# EAGLE design ADC Keychain (EAGLE 7.1.0)
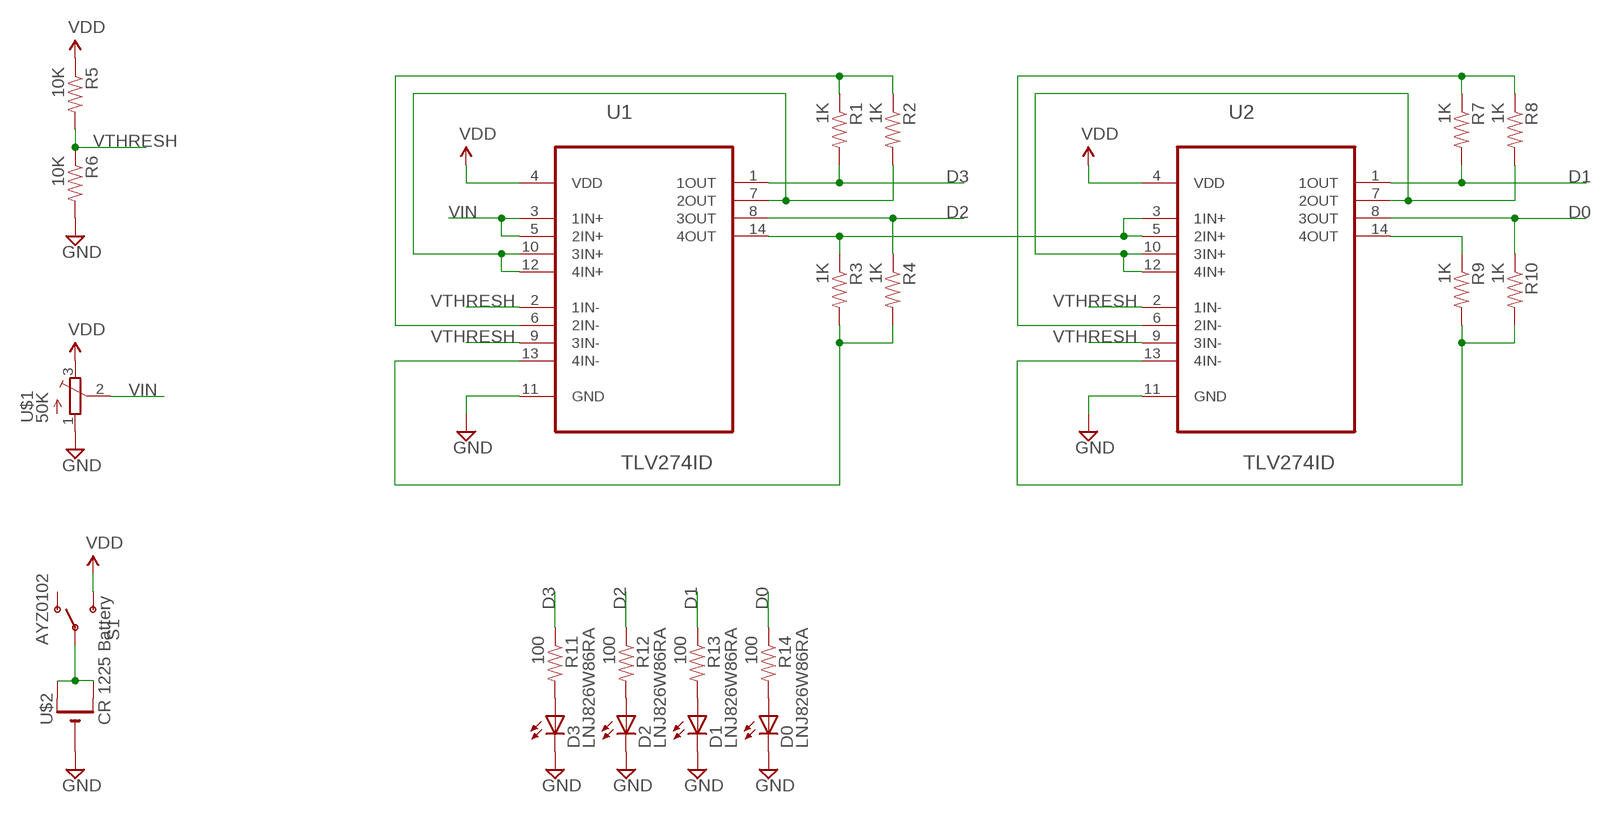
[diagram p0: schematic, sheet 1]

## Parts
D0  LNJ826W86RA  LEDCHIP-LED0603  [CHIP-LED0603]
D1  LNJ826W86RA  LEDCHIP-LED0603  [CHIP-LED0603]
D2  LNJ826W86RA  LEDCHIP-LED0603  [CHIP-LED0603]
D3  LNJ826W86RA  LEDCHIP-LED0603  [CHIP-LED0603]
R1  1K  1KOHM1/10W1%(0603)  [0603-RES]
R2  1K  1KOHM1/10W1%(0603)  [0603-RES]
R3  1K  1KOHM1/10W1%(0603)  [0603-RES]
R4  1K  1KOHM1/10W1%(0603)  [0603-RES]
R5  10K  1KOHM1/10W1%(0603)  [0603-RES]
R6  10K  1KOHM1/10W1%(0603)  [0603-RES]
R7  1K  1KOHM1/10W1%(0603)  [0603-RES]
R8  1K  1KOHM1/10W1%(0603)  [0603-RES]
R9  1K  1KOHM1/10W1%(0603)  [0603-RES]
R10  1K  1KOHM1/10W1%(0603)  [0603-RES]
R11  100  1KOHM1/10W1%(0603)  [0603-RES]
R12  100  1KOHM1/10W1%(0603)  [0603-RES]
R13  100  1KOHM1/10W1%(0603)  [0603-RES]
R14  100  1KOHM1/10W1%(0603)  [0603-RES]
S1  AYZ0102  SWITCH-SPDTSMD2  [SWITCH-SPDT-SMD]
U1  TLV274ID  [SOIC127P600X175-14N]
U2  TLV274ID  [SOIC127P600X175-14N]
U$1  50K  TRIMPOTTC33X  [TC33X]
U$2  CR 1225 Battery  CR1220SMT  [CR1220-SMD]

## Nets
D0: R10.1 R14.1 U2.8(3OUT)
D1: R7.2 R13.1 U2.1(1OUT)
D2: R4.1 R12.1 U1.8(3OUT)
D3: R1.2 R11.1 U1.1(1OUT)
GND: D0.C D1.C D2.C D3.C R6.2 U1.11(GND) U2.11(GND) U$1.1(A) U$2.-
N$1: D3.A R11.2
N$2: D2.A R12.2
N$3: R7.1 R8.1 U2.6(2IN-)
N$4: R1.1 R2.1 U1.6(2IN-)
N$5: R3.1 U1.14(4OUT) U2.3(1IN+) U2.5(2IN+)
N$6: D1.A R13.2
N$7: R3.2 R4.2 U1.13(4IN-)
N$8: R2.2 U1.7(2OUT) U1.10(3IN+) U1.12(4IN+)
N$9: R9.1 U2.14(4OUT)
N$10: D0.A R14.2
N$11: R9.2 R10.2 U2.13(4IN-)
N$12: R8.2 U2.7(2OUT) U2.10(3IN+) U2.12(4IN+)
N$14: S1.2(P) U$2.+$1(+) U$2.+$2(+1)
VDD: R5.1 S1.3(S) U1.4(VDD) U2.4(VDD) U$1.3(E)
VIN: U1.3(1IN+) U1.5(2IN+) U$1.2(S)
VTHRESH: R5.2 R6.1 U1.2(1IN-) U1.9(3IN-) U2.2(1IN-) U2.9(3IN-)
Unconnected: S1.1(O)

## Library data of the parts
D0 D1-D3 = led:LED: LED OSRAM: - CHIPLED LG R971, LG N971, LY N971, LG Q971, LY Q971, LO R971, LY R971 LH N974, LH R974 LS Q976, LO Q976, LY Q976 LO Q996 - Hyper CHIPLED LW Q18S LB Q993, LB Q99A, LB R99A - SideLED LS A670, LO A670, LY A670, LG A670, LP A670 LB A673, LV A673, LT A673, LW A673 LH A674 LY A675 LS A676, LA A676, LO A676, LY A676, LW A676 LS A679, LY A679, LG A679 - Hyper Micro SIDELED® LS Y876, LA Y876, LO Y876, LY Y876 LT Y87S - SmartLED LW L88C, LW L88S LB L89C, LB L89S, LG L890 LS L89K, LO L89K, LY L89K LS L896, LA L896, LO L896, LY L896 - TOPLED LS T670, LO T670, LY T670, LG T670, LP T670 LSG T670, LSP T670, LSY T670, LOP T670, LYG T670 LG T671, LOG T671, LSG T671 LB T673, LV T673, LT T673, LW T673 LH T674 LS T676, LA T676, LO T676, LY T676, LB T676, LH T676, LSB T676, LW T676 LB T67C, LV T67C, LT T67C, LS T67K, LO T67K, LY T67K, LW E67C LS E67B, LA E67B, LO E67B, LY E67B, LB E67C, LV E67C, LT E67C LW T67C LS T679, LY T679, LG T679 LS T770, LO T770, LY T770, LG T770, LP T770 LB T773, LV T773, LT T773, LW T773 LH T774 LS E675, LA E675, LY E675, LS T675 LS T776, LA T776, LO T776, LY T776, LB T776 LHGB T686 LT T68C, LB T68C - Hyper Mini TOPLED® LB M676 - Mini TOPLED Santana® LG M470 LS M47K, LO M47K, LY M47K Source: http://www.osram.convergy.de LUXEON: - LUMILED® LXK2-PW12-R00, LXK2-PW12-S00, LXK2-PW14-U00, LXK2-PW14-V00 LXK2-PM12-R00, LXK2-PM12-S00, LXK2-PM14-U00 LXK2-PE12-Q00, LXK2-PE12-R00, LXK2-PE12-S00, LXK2-PE14-T00, LXK2-PE14-U00 LXK2-PB12-K00, LXK2-PB12-L00, LXK2-PB12-M00, LXK2-PB14-N00, LXK2-PB14-P00, LXK2-PB14-Q00 LXK2-PR12-L00, LXK2-PR12-M00, LXK2-PR14-Q00, LXK2-PR14-R00 LXK2-PD12-Q00, LXK2-PD12-R00, LXK2-PD12-S00 LXK2-PH12-R00, LXK2-PH12-S00 LXK2-PL12-P00, LXK2-PL12-Q00, LXK2-PL12-R00 Source: www.luxeon.com KINGBRIGHT: KA-3528ASYC Source: www.kingbright.com
R1-R4 R7-R10 = SparkFun-Resistors:1KOHM1/10W1%(0603): RES-07856; PROD_ID: RES-07856
R5 R6 R11-R14 = SparkFun-Resistors:1KOHM1/10W1%(0603): RES-07856; PROD_ID: RES-07856; VALUE: 1K
S1 = SparkFun-Electromechanical:SWITCH-SPDT: SPDT Switch Simple slide switch, Spark Fun Electronics SKU : COM-00102 DPDT SMT slide switch, AYZ0202, SWCH-08179
U1 U2 = Texas Instruments_By_element14_Batch_1:TLV274ID: RAIL-TO-TO-RAIL OUTPUT OPAMP; MPN: TLV274ID; OC_FARNELL: 8455317; OC_NEWARK: 38K8452; PACKAGE: SOIC-14; SUPPLIER: Texas Instruments
U$1 = adafruit:TRIMPOT: SMT trimmer potentiometer part number TC33X http://www.ladyada.net/library/eagle
U$2 = adafruit:CR1220: CR1216/CR1220/CR1225 12mm 3V lithium coin cell Great for battery packup. Both SMT and THM holders. Note the THM package has the ground pads on both sides of the PCB so that the masks are the same - this reduces the cost

## Board
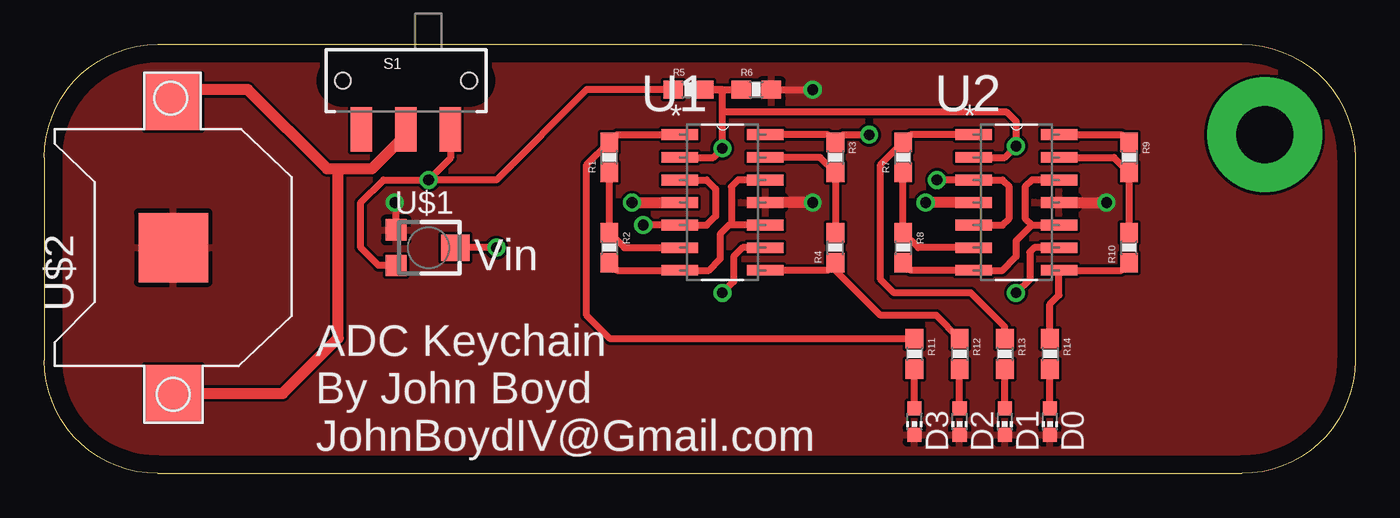
[diagram p1: board, top side]
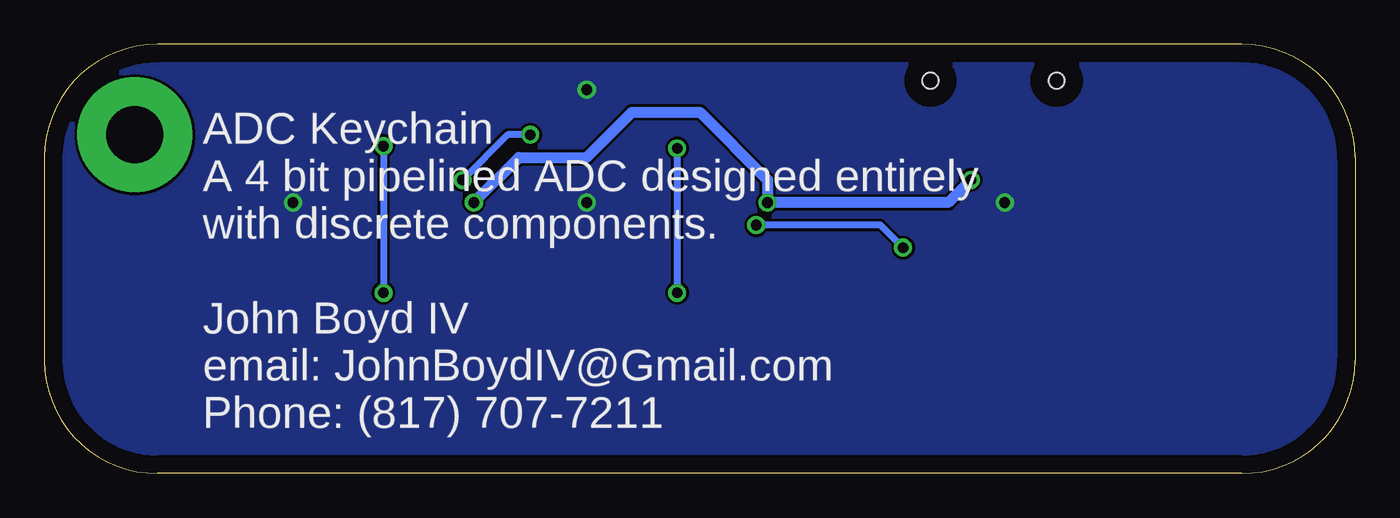
[diagram p2: board, bottom side, seen from below]

Size 73.66 x 24.13 mm. Coordinates in mm from the lower left corner, seen from the top.
Outline: 6.35,0 67.31,0 arc90 73.66,6.35 73.66,17.78 arc90 67.31,24.13 6.35,24.13 arc90 0,17.78 0,6.35 arc90 6.35,0
Copper layers (1*16): Top 0.035mm / dielectric 1.5mm / Bottom 0.035mm
Design rules "default *": minimum track width 10mil, minimum drill 13mil, track to track 6mil, track to pad 6mil, pad to pad 6mil, via to via 6mil, smd to smd 6mil, copper to edge 40mil, drill to drill 8mil, minimum pad ring 10mil, minimum via ring 8mil, stop-mask expansion 4mil, vias tented up to drill 0mil, thermal gap 10mil

### Footprints (pad centres in the part's own frame; a part is rotated, then mirrored left to right if it is on the bottom)
CHIP-LED0603 = smd 0.8 x 0.8: A 0,-0.75; C 0,0.75
0603-RES = smd 1.1 x 1: 1 -0.85,0; 2 0.85,0
SWITCH-SPDT-SMD = smd 1.2 x 2.5: 1 -2.5,-2.75; 2 0,-2.75; 3 2.5,-2.75 | hole 0.9: -3.55,0; 3.55,0
SOIC127P600X175-14N = smd 2.057 x 0.61: 1 -4.801,7.62; 2 -4.801,6.35; 3 -4.801,5.08; 4 -4.801,3.81; 5 -4.801,2.54; 6 -4.801,1.27; 7 -4.801,0; 8 0,0; 9 0,1.27; 10 0,2.54; 11 0,3.81; 12 0,5.08; 13 0,6.35; 14 0,7.62
TC33X = smd 1.2 x 1.2: 1 -1,-1.825; 3 1,-1.825 | smd 1.5 x 1.6: 2 0,1.5
CR1220-SMD = smd 3.2 x 3.2: +$1 -8.2,0; +$2 8.2,0 | smd 3.9 x 3.9: - 0,0

### Placement (x,y rotation side)
D0  56.52,2.92 180 top
D1  53.98,2.92 180 top
D2  51.44,2.92 180 top
D3  48.9,2.92 180 top
R1  31.75,17.78 90 top
R2  31.75,12.7 270 top
R3  44.45,17.78 270 top
R4  44.45,12.7 90 top
R5  36.2,21.59 0 top
R6  40.01,21.59 0 top
R7  48.26,17.78 90 top
R8  48.26,12.7 270 top
R9  60.96,17.78 270 top
R10  60.96,12.7 90 top
R11  48.9,6.73 270 top
R12  51.44,6.73 270 top
R13  53.98,6.73 270 top
R14  56.52,6.73 270 top
S1  20.32,22.1 0 top
U1  40.51,11.43 0 top
U2  57.02,11.43 0 top
U$1  21.59,12.7 270 top
U$2  7.24,12.7 90 top

### Tracks (layer width: path | path; a pad name or v marks a point on that pad's centre or on a via)
D0
  Top 0.406: R10.1 60.54,11.43 U2.8 57.02,10.03 56.52,9.53 R14.1
D1
  Top 0.406: U2.1 48.68,19.05 R7.2 46.99,17.36 46.99,10.92 47.75,10.16 52.07,10.16 53.98,8.26 R13.1
D2
  Top 0.406: U1.8 44.03,11.43 R4.1 44.45,11.43 46.99,8.89 50.13,8.89 R12.1
D3
  Top 0.406: U1.1 32.17,19.05 R1.2 30.48,17.36 30.48,8.89 31.79,7.58 R11.1
GND  (via drill 0.6, 0.6 pad 1.02)
  Top 0.406: R6.2 v43.18,21.59 | U$1.1 19.77,15.16 v19.68,15.24
  Top 0.61: v43.18,15.24 U1.11 | U2.11 v59.69,15.24
  pour Top: 6.35,0 arc-90 0,6.35 0,17.78 arc-90 6.35,24.13 67.31,24.13 arc-90 73.66,17.78 73.66,6.35 arc-90 67.31,0
  pour Bottom: 6.35,0 arc-90 0,6.35 0,17.78 arc-90 6.35,24.13 67.31,24.13 arc-90 73.66,17.78 73.66,6.35 arc-90 67.31,0
N$1
  Top 0.406: D3.A R11.2
N$2
  Top 0.406: D2.A R12.2
N$3
  Top 0.406: U2.6 49.11,12.7 R8.1 R7.1
N$4
  Top 0.406: R1.1 R2.1 32.6,12.7 U1.6
N$5  (via drill 0.6, 0.6 pad 1.02)
  Top 0.406: U1.14 44.03,19.05 R3.1 44.87,19.05 v46.35,19.05 | U2.5 53.85,13.97 54.23,14.35 54.23,16.13 53.85,16.51 U2.3 v50.16,16.51
  Bottom 0.406: v46.35,19.05 47.62,19.05 v50.16,16.51
N$6
  Top 0.406: D1.A R13.2
N$7
  Top 0.406: R4.2 R3.2 43.6,17.78 U1.13
N$8
  Top 0.406: R2.2 32.17,11.43 U1.7 37.34,11.43 37.97,12.06 37.97,13.46 38.48,13.97 | U1.10 38.48,13.97 | U1.12 38.99,16.51 38.61,16.13 38.61,14.1 38.48,13.97
N$9
  Top 0.406: U2.14 60.54,19.05 R9.1
N$10
  Top 0.406: D0.A R14.2
N$11
  Top 0.406: U2.13 60.11,17.78 R9.2 R10.2
N$12
  Top 0.406: R8.2 48.68,11.43 U2.7 53.85,11.43 54.61,12.19 54.61,13.08 55.5,13.97 | 57.15,16.51 U2.12 55.5,16.51 55.12,16.13 55.12,14.35 55.5,13.97 | 55.5,13.97 U2.10
N$14
  Top 0.406: 6.35,21.59 7.24,21.59 U$2.+$2
  Top 0.61: 16.51,17.14 18.41,17.14 20.32,19.05 S1.2 | U$2.+$1 13.39,4.5 16.51,7.62 16.51,17.14 | 16.51,17.14 15.88,17.14 11.43,21.59 7.24,21.59
N$15  (via drill 3.2 pad 6.45)
  other vias: 68.58,19.05
VDD  (via drill 0.6, 0.6 pad 1.02)
  Top 0.406: U$1.3 18.78,11.7 17.78,12.7 17.78,15.24 19.05,16.51 v21.59,16.51 | 35.56,21.59 R5.1 30.48,21.59 25.4,16.51 v21.59,16.51 | S1.3 22.82,17.74 v21.59,16.51
  Top 0.61: v21.59,16.51 21.55,16.55 | v33.02,15.24 U1.4 | U2.4 v49.53,15.24
  Bottom 0.61: v49.53,15.24 46.99,17.78 43.18,17.78 40.64,20.32 36.83,20.32 33.02,16.51 v33.02,15.24 22.86,15.24 v21.59,16.51
VIN  (via drill 0.6 pad 1.02)
  Top 0.406: U1.3 37.21,16.51 37.72,16 37.72,14.48 37.21,13.97 U1.5 v33.66,13.97 | v25.4,12.7 U$1.2
  Bottom 0.406: v25.4,12.7 26.67,13.97 v33.66,13.97
VTHRESH  (via drill 0.6, 0.6 pad 1.02)
  Top 0.406: U1.9 39.24,12.7 38.73,12.19 38.73,10.79 v38.1,10.16 | U1.2 37.59,17.78 v38.1,18.29 38.1,20.32 | 38.1,20.32 38.1,21.59 R5.2 R6.1 | 38.1,20.32 54.1,20.32 54.61,19.81 v54.61,18.41 53.98,17.78 U2.2 | U2.9 55.63,12.7 55.37,12.45 55.37,10.92 v54.61,10.16
  Bottom 0.406: v38.1,18.29 v38.1,10.16 | v54.61,18.41 v54.61,10.16

### Text on the board
_tsilk: Vin | ADC Keychain / By John Boyd / JohnBoydIV@Gmail.com
_bsilk: ADC Keychain / A 4 bit pipelined ADC designed entirely / with discrete components. / / John Boyd IV / email: JohnBoydIV@Gmail.com / Phone: (817) 707-7211